# EAGLE schematic rev1 (EAGLE 7.2.0)
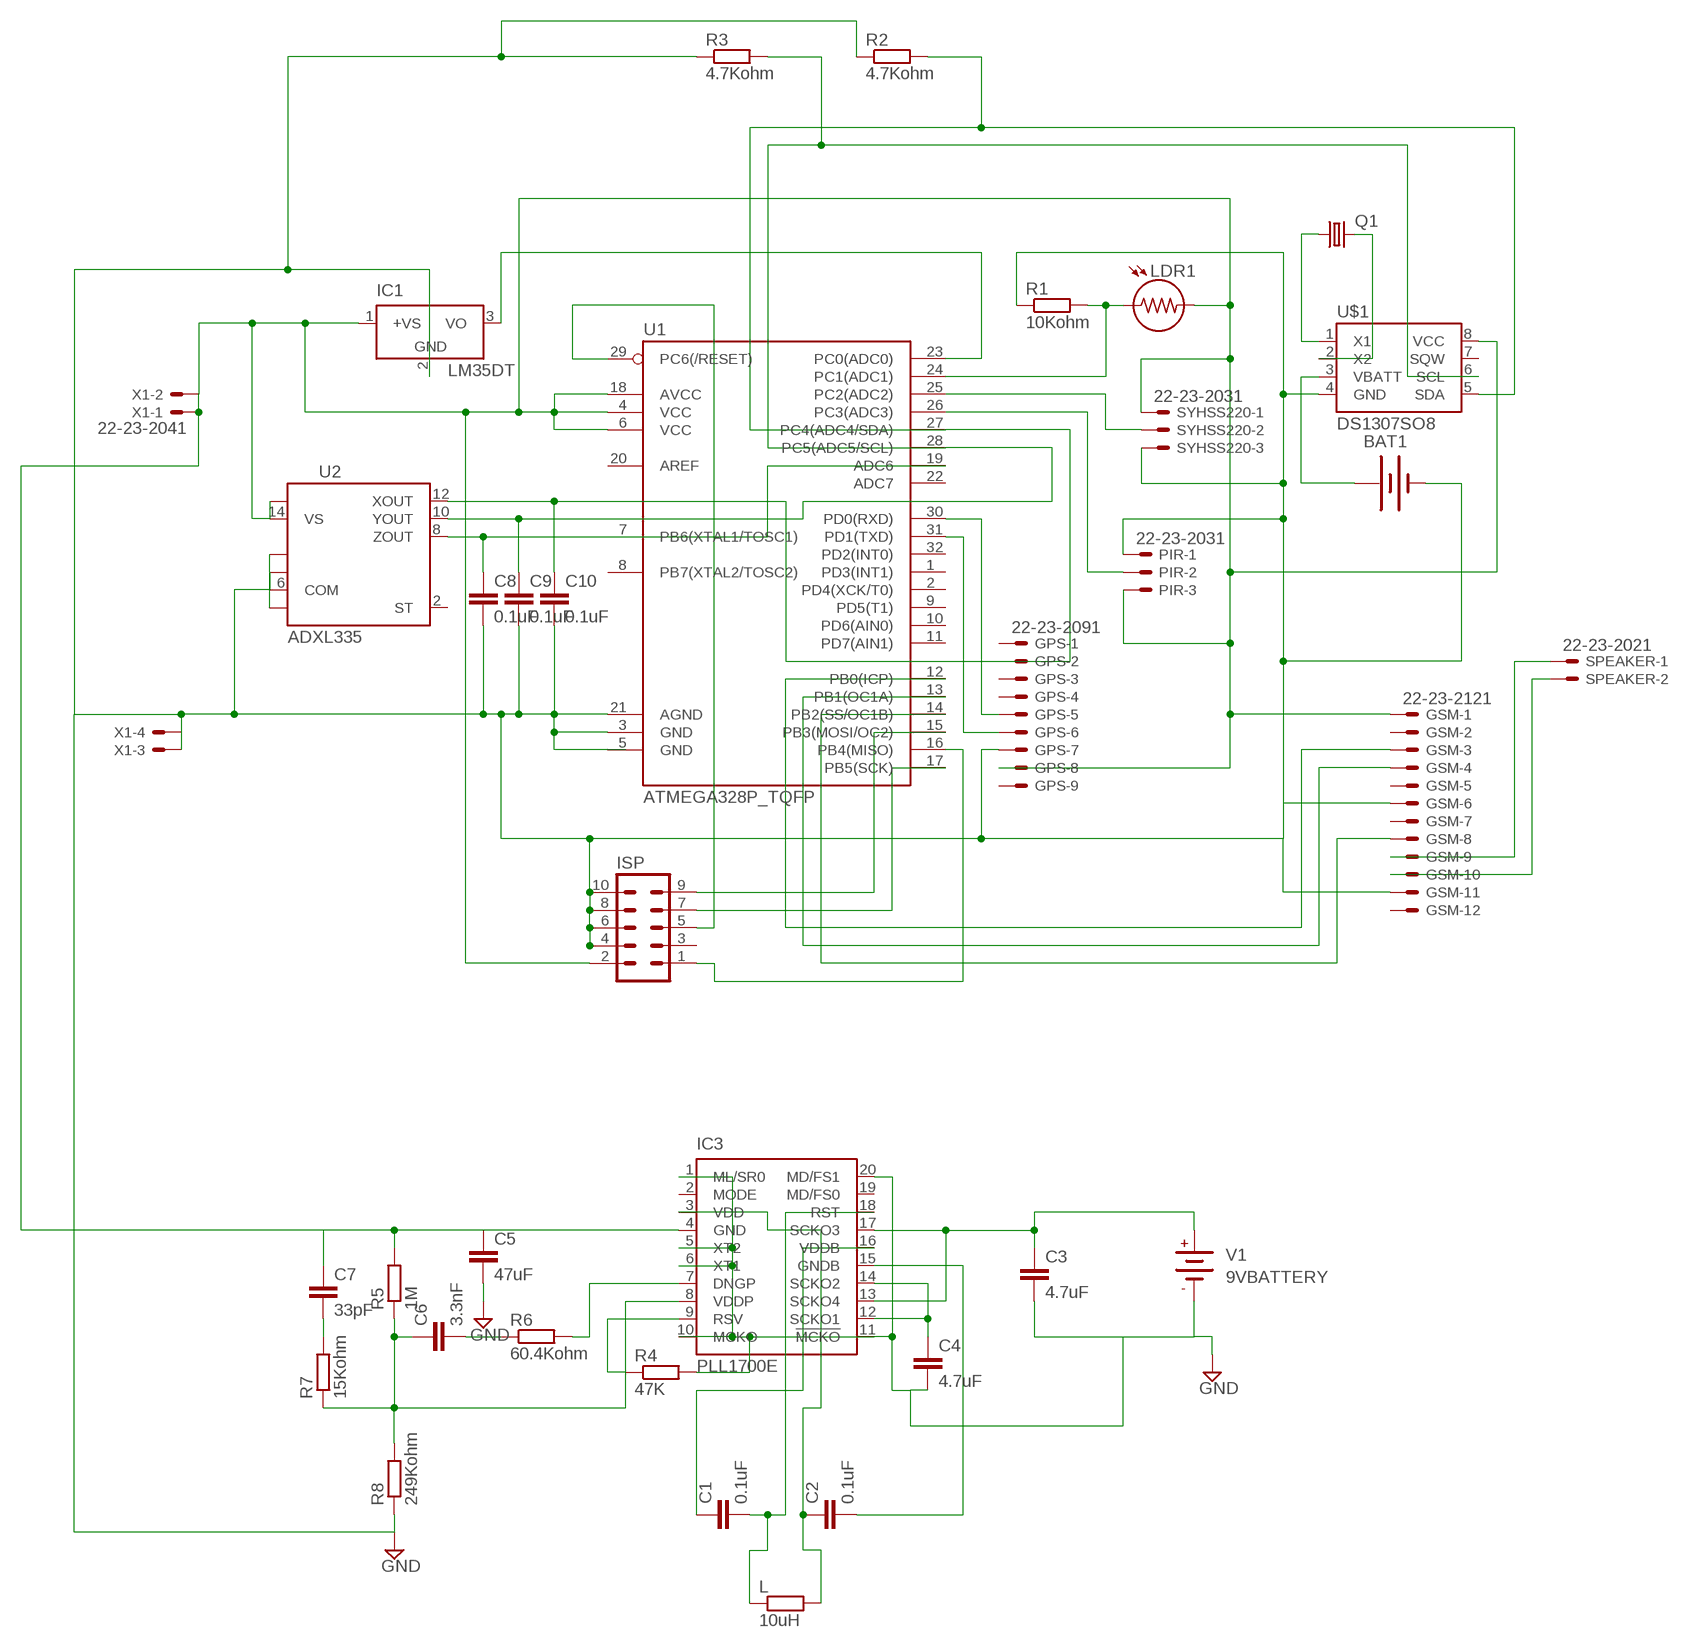
[diagram p0: schematic, sheet 1]

## Parts
BAT1  BATTERY20PTH  [BATTCOM_20MM_PTH]
C1  0.1uF  0.1UF-16V(+-10%)(0402)  [0402-CAP]
C2  0.1uF  0.1UF-16V(+-10%)(0402)  [0402-CAP]
C3  4.7uF  4.7UF-6.3V-10%(0603)0603  [0603-CAP]
C4  4.7uF  4.7UF-6.3V-10%(0603)0603  [0603-CAP]
C5  47uF  CAP0603-CAP  [0603-CAP]
C6  3.3nF  3.3NF-100V-10%(0603)  [0603-CAP]
C7  33pF  33PF-50V-5%-(0603)  [0603-CAP]
C8  0.1uF  0.1UF-16V(+-10%)(0402)  [0402-CAP]
C9  0.1uF  0.1UF-16V(+-10%)(0402)  [0402-CAP]
C10  0.1uF  0.1UF-16V(+-10%)(0402)  [0402-CAP]
GPS  22-23-2091  [22-23-2091]
GSM  22-23-2121  [22-23-2121]
IC1  LM35DT  [TO220V]
IC3  PLL1700E  [SSOP20]
ISP  ML10  [ML10]
L  10uH  6MM-EU4  [R0207/4]
LDR1  LDR5MM  [LDR338-54C]
PIR  22-23-2031  [22-23-2031]
Q1  CRYSTALTC26H  [TC26H]
R1  10Kohm  R-EU_M1206  [M1206]
R2  4.7Kohm  R-EU_M1206  [M1206]
R3  4.7Kohm  R-EU_M1206  [M1206]
R4  47K  R-EU_M3216  [M3216]
R5  1M  R-EU_M3216  [M3216]
R6  60.4Kohm  R-EU_M3216  [M3216]
R7  15Kohm  R-EU_M1206  [M1206]
R8  249Kohm  R-EU_M1206  [M1206]
SPEAKER  22-23-2021  [22-23-2021]
SYHSS220  22-23-2031  [22-23-2031]
U1  ATMEGA328P_TQFP  [TQFP32-08]
U2  ADXL335  [LFCSP-16]
U$1  DS1307SO8  [SO08]
V1  9VBATTERY  [AB9V]
X1  22-23-2041  [22-23-2041]

## Nets
GND: BAT1.2(-) C3.2 C4.2 C5.2 C8.2 C9.2 C10.2 GPS.7 GSM.6 GSM.11 IC1.2(GND) IC3.1(ML/SR0) IC3.5(XT2) IC3.6(XT1) IC3.10(MCKO) IC3.11(!MCKO) IC3.20(MD/FS1) ISP.4 ISP.6 ISP.8 ISP.10 PIR.1 R1.1 R2.1 R3.1 R4.2 R8.1 SYHSS220.3 U1.3(GND) U1.21(AGND) U2.3(COM) U2.5(COM) U2.6(COM) U2.7(COM) U$1.4(GND) V1.- X1.3 X1.4
N$3: GPS.5 U1.30(PD0(RXD))
N$4: IC1.3(VO) U1.23(PC0(ADC0))
N$5: LDR1.1 R1.2 U1.24(PC1(ADC1))
N$6: GPS.6 U1.31(PD1(TXD))
N$7: SYHSS220.2 U1.25(PC2(ADC2))
N$8: PIR.2 U1.26(PC3(ADC3))
N$9: C8.1 U1.19(ADC6) U2.8(ZOUT)
N$10: C9.1 R3.2 U1.28(PC5(ADC5/SCL)) U2.10(YOUT) U$1.6(SCL)
N$11: GSM.3 U1.12(PB0(ICP))
N$12: Q1.1 U$1.1(X1)
N$13: Q1.2 U$1.2(X2)
N$14: GSM.4 U1.13(PB1(OC1A))
N$15: BAT1.1(+) U$1.3(VBATT)
N$16: GSM.8 U1.14(PB2(SS/OC1B))
N$17: GSM.10 SPEAKER.2
N$18: GSM.9 SPEAKER.1
N$20: ISP.1 U1.16(PB4(MISO))
N$21: ISP.5 U1.29(PC6(/RESET))
N$22: ISP.7 U1.17(PB5(SCK))
N$23: ISP.9 U1.15(PB3(MOSI/OC2))
N$29: C1.1 IC3.16(VDDB)
N$32: C2.2 IC3.15(GNDB)
N$35: C1.2 IC3.18(RST) L.1
N$36: C2.1 IC3.3(VDD) L.2
N$37: C5.1 C7.1 GPS.8 GSM.1 IC1.1(+VS) IC3.4(GND) ISP.2 LDR1.2 PIR.3 R5.2 SYHSS220.1 U1.4(VCC) U1.6(VCC) U1.18(AVCC) U2.14(VS) U2.15(VS) U$1.8(VCC) X1.1 X1.2
N$38: C6.1 IC3.8(VDDP) R5.1 R7.1 R8.2
N$39: C3.1 IC3.13(SCKO4) IC3.17(SCKO3) V1.+
N$40: C6.2 R6.1
N$41: IC3.7(DNGP) R6.2
N$42: C10.1 R2.2 U1.27(PC4(ADC4/SDA)) U2.12(XOUT) U$1.5(SDA)
N$43: C7.2 R7.2
N$44: C4.1 IC3.12(SCKO1) IC3.14(SCKO2)
N$45: IC3.9(RSV) R4.1
Unconnected: GPS.1 GPS.2 GPS.3 GPS.4 GPS.9 GSM.2 GSM.5 GSM.7 GSM.12 IC3.2(MODE) IC3.19(MD/FS0) ISP.3 U1.1(PD3(INT1)) U1.2(PD4(XCK/T0)) U1.5(GND) U1.7(PB6(XTAL1/TOSC1)) U1.8(PB7(XTAL2/TOSC2)) U1.9(PD5(T1)) U1.10(PD6(AIN0)) U1.11(PD7(AIN1)) U1.20(AREF) U1.22(ADC7) U1.32(PD2(INT0)) U2.2(ST) U$1.7(SQW)

## Library data of the parts
BAT1 = SparkFun:BATTERY: Battery Holders Various common sizes : AA, AAA, 20mm coin cell and 12mm coin cell.
C1 C2 C8-C10 = SparkFun-Capacitors:0.1UF-16V(+-10%)(0402); PROD_ID: CAP-12416
C3 C4 = SparkFun-Capacitors:4.7UF-6.3V-10%(0603): CAP-08280; PROD_ID: CAP-08280
C5 = SparkFun:CAP: Capacitor Standard 0603 ceramic capacitor, and 0.1" leaded capacitor.
C6 = SparkFun-Capacitors:3.3NF-100V-10%(0603): CAP-09633; PROD_ID: CAP-09633
C7 = SparkFun-Capacitors:33PF-50V-5%-(0603): CAP-10142; PROD_ID: CAP-10142
GPS = con-molex:22-23-2091: .100" (2.54mm) Center Header - 9 Pin; MF: MOLEX; MPN: 22-23-2091; OC_FARNELL: 1756827; OC_NEWARK: 56H0450
GSM = con-molex:22-23-2121: .100" (2.54mm) Center Header - 12 Pin; MF: MOLEX; MPN: 22-23-2121; OC_FARNELL: 1462935; OC_NEWARK: 56H0456
IC1 = lm35:LM35: Single-Supply Centigrade Temperature Sensor Vout = (10mV/°C x Temp °C) +5mmmV Source: http://www.national.com/ds/LM/LM35.pdf
IC3 = texas:PLL1700*: MULTI-CLOCK GENERATOR GENERATED AUDIO SYSTEM CLOCK Phase Lock Loop (PLL).; MF: TEXAS INSTRUMENT CONNECTORS; MPN: PLL1700E; OC_FARNELL: unknown; OC_NEWARK: 36K3452
ISP = con-harting-ml:ML10: HARTING; OC_FARNELL: unknown; OC_NEWARK: unknown
L = gm-resistors:6MM-EU: 6mm Resistors (European schematic symbol) Leads spaced 1-6 holes apart for 0.1" perfboard. Suitable for 1/4 watt resistors.
LDR1 = gm-resistors:LDR
PIR SYHSS220 = con-molex:22-23-2031: .100" (2.54mm) Center Header - 3 Pin; MF: MOLEX; MPN: 22-23-2031; OC_FARNELL: 1462950; OC_NEWARK: 30C0862
Q1 = crystal:CRYSTAL: CRYSTAL; OC_FARNELL: unknown; OC_NEWARK: unknown
R1-R8 = resistor:R-EU_: RESISTOR, European symbol
SPEAKER = con-molex:22-23-2021: .100" (2.54mm) Center Header - 2 Pin; MF: MOLEX; MPN: 22-23-2021; OC_FARNELL: 1462926; OC_NEWARK: 25C3832
U1 = SparkFun-DigitalIC:ATMEGA328P_TQFP; PROD_ID: IC-09069
U2 = SparkFun-Sensors:ADXL335: 3-axis, 3g accelerometer, analog out
U$1 = SparkFun:DS1307
V1 = gm-supply:9VBATTERY
X1 = con-molex:22-23-2041: .100" (2.54mm) Center Header - 4 Pin; MF: MOLEX; MPN: 22-23-2041; OC_FARNELL: 1462920; OC_NEWARK: 38C0355